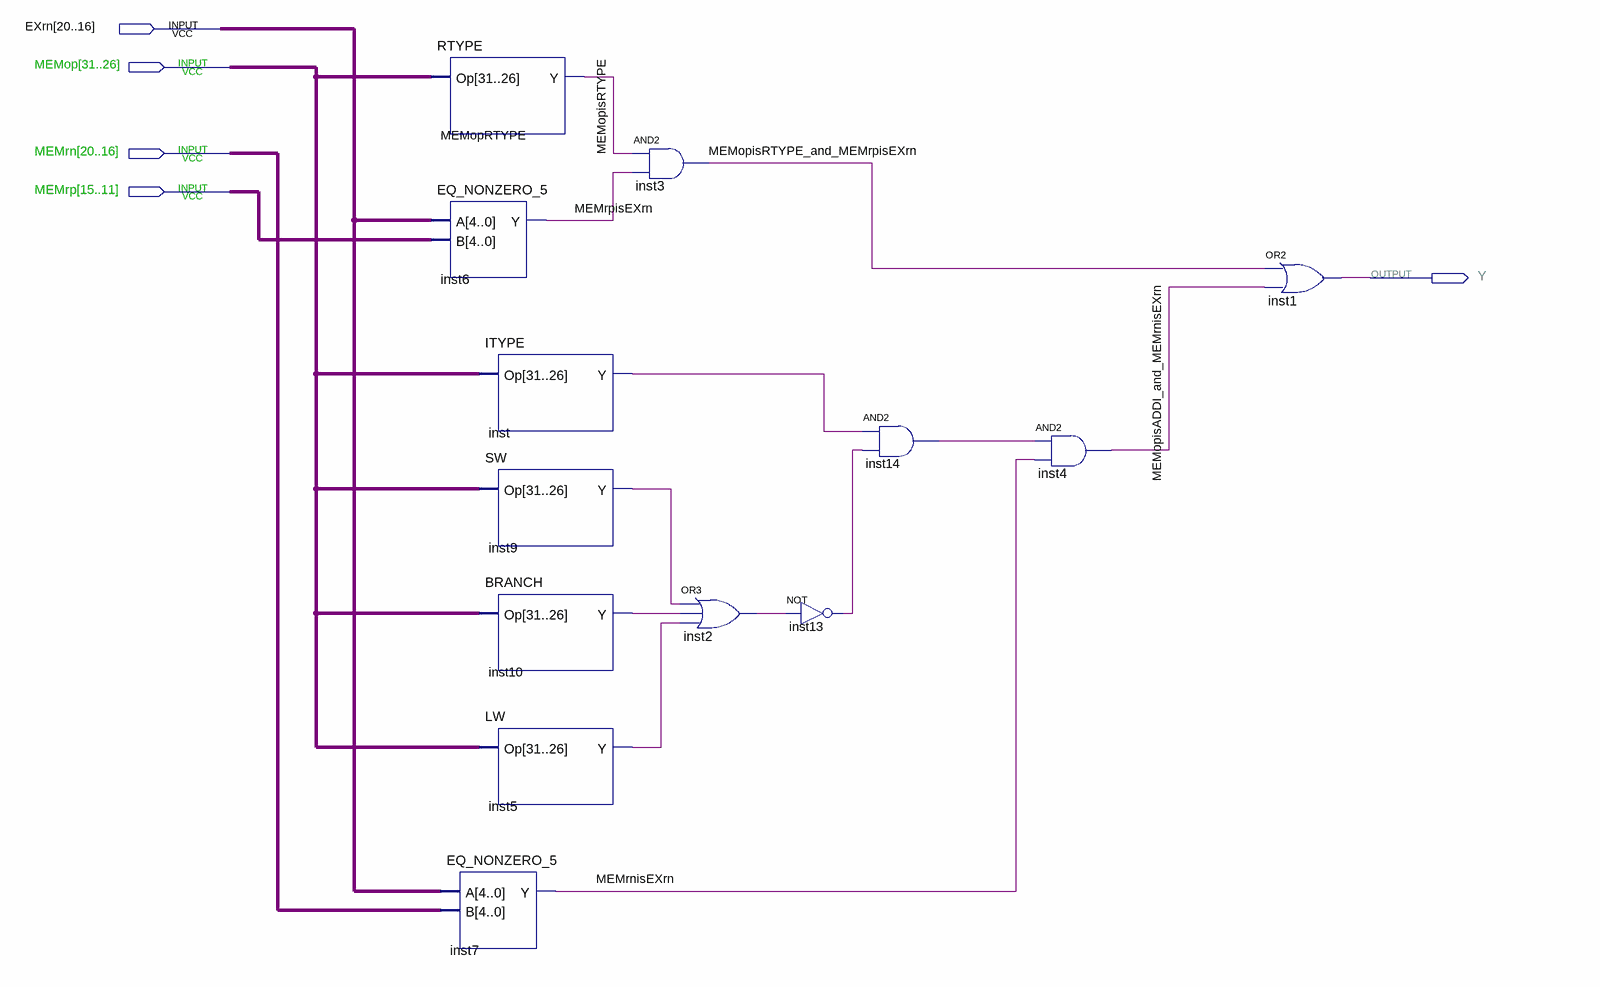
[diagram p0: schematic sheet]
// Quartus schematic ForwardBfromMEMtoEX.bdf as structural Verilog: 13 symbols, 5 pins
module ForwardBfromMEMtoEX (
  input  [20:16] EXrn,
  input  [31:26] MEMop,
  input  [20:16] MEMrn,
  input  [15:11] MEMrp,
  output Y
);

  wire inst2_out, inst5_y, inst9_y, inst10_y, inst13_out, inst14_out, inst_y, MEMopisADDI_and_MEMrnisEXrn,
       MEMopisRTYPE, MEMopisRTYPE_and_MEMrpisEXrn, MEMrnisEXrn, MEMrpisEXrn;

  RTYPE MEMopRTYPE (.Op(MEMop), .Y(MEMopisRTYPE));
  EQ_NONZERO_5 inst6 (.A(EXrn), .B(MEMrp), .Y(MEMrpisEXrn));
  ITYPE inst (.Op(MEMop), .Y(inst_y));
  SW inst9 (.Op(MEMop), .Y(inst9_y));
  BRANCH inst10 (.Op(MEMop), .Y(inst10_y));
  LW inst5 (.Op(MEMop), .Y(inst5_y));
  EQ_NONZERO_5 inst7 (.A(EXrn), .B(MEMrn), .Y(MEMrnisEXrn));
  and inst3 (MEMopisRTYPE_and_MEMrpisEXrn, MEMopisRTYPE, MEMrpisEXrn);
  or inst2 (inst2_out, inst9_y, inst10_y, inst5_y);
  not inst13 (inst13_out, inst2_out);
  and inst14 (inst14_out, inst_y, inst13_out);
  and inst4 (MEMopisADDI_and_MEMrnisEXrn, inst14_out, MEMrnisEXrn);
  or inst1 (Y, MEMopisRTYPE_and_MEMrpisEXrn, MEMopisADDI_and_MEMrnisEXrn);
endmodule
